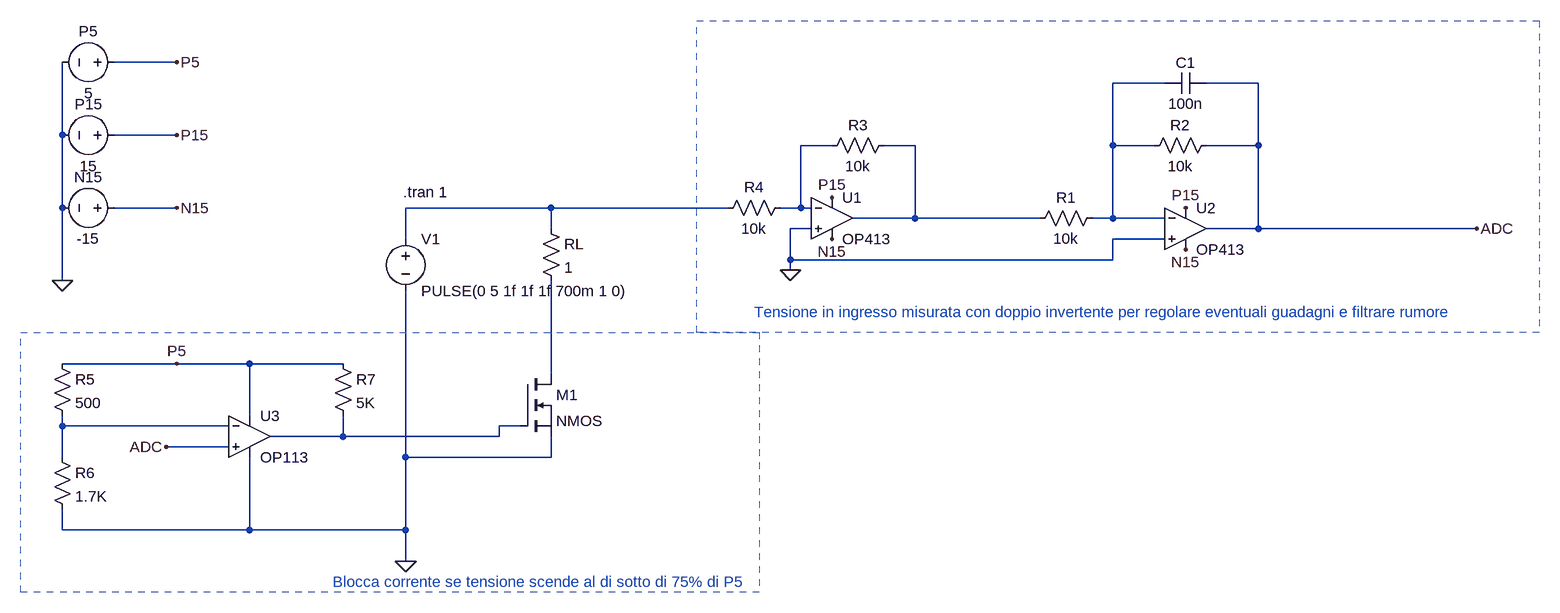
[diagram p0: schematic Circuito_Sorveglianza_Alimentazione.asc]
Circuito_Sorveglianza_Alimentazione.asc, the LTspice schematic file:
Version 4
SHEET 1 1748 680
WIRE -400 -288 -496 -288
WIRE 1120 -256 1040 -256
WIRE 1264 -256 1184 -256
WIRE -576 -176 -576 -288
WIRE -400 -176 -496 -176
WIRE 608 -160 560 -160
WIRE 736 -160 688 -160
WIRE 1040 -160 1040 -256
WIRE 1104 -160 1040 -160
WIRE 1264 -160 1264 -256
WIRE 1264 -160 1184 -160
WIRE -576 -64 -576 -176
WIRE -400 -64 -496 -64
WIRE 176 -64 -48 -64
WIRE 448 -64 176 -64
WIRE 560 -64 560 -160
WIRE 560 -64 528 -64
WIRE 576 -64 560 -64
WIRE 736 -48 736 -160
WIRE 736 -48 640 -48
WIRE 928 -48 736 -48
WIRE 1040 -48 1040 -160
WIRE 1040 -48 1008 -48
WIRE 1120 -48 1040 -48
WIRE 176 -32 176 -64
WIRE 576 -32 544 -32
WIRE 1264 -32 1264 -160
WIRE 1264 -32 1184 -32
WIRE 1600 -32 1264 -32
WIRE -48 -16 -48 -64
WIRE 1120 -16 1040 -16
WIRE 544 16 544 -32
WIRE 1040 16 1040 -16
WIRE 1040 16 544 16
WIRE 544 32 544 16
WIRE -576 48 -576 -64
WIRE -400 176 -576 176
WIRE -288 176 -400 176
WIRE -144 176 -288 176
WIRE 176 192 176 48
WIRE -288 256 -288 176
WIRE -576 272 -576 256
WIRE -320 272 -576 272
WIRE 128 272 96 272
WIRE -144 288 -144 256
WIRE -144 288 -256 288
WIRE 96 288 96 272
WIRE 96 288 -144 288
WIRE -320 304 -416 304
WIRE -576 320 -576 272
WIRE -48 320 -48 64
WIRE 176 320 176 288
WIRE 176 320 -48 320
WIRE -576 432 -576 400
WIRE -288 432 -288 320
WIRE -288 432 -576 432
WIRE -48 432 -48 320
WIRE -48 432 -288 432
WIRE -48 480 -48 432
FLAG 1600 -32 ADC
FLAG -576 48 0
FLAG -400 -64 N15
FLAG -400 -176 P15
FLAG 608 -80 P15
FLAG 608 -16 N15
FLAG 544 32 0
FLAG 1152 -64 P15
FLAG 1152 0 N15
FLAG -416 304 ADC
FLAG -400 176 P5
FLAG -400 -288 P5
FLAG -48 480 0
SYMBOL voltage -48 -32 R0
WINDOW 123 0 0 Left 0
WINDOW 39 0 0 Left 0
SYMATTR InstName V1
SYMATTR Value PULSE(0 5 1f 1f 1f 700m 1 0)
SYMBOL res 160 -48 R0
SYMATTR InstName RL
SYMATTR Value 1
SYMBOL nmos 128 192 R0
SYMATTR InstName M1
SYMBOL OpAmps\\OP413 608 -112 R0
SYMATTR InstName U1
SYMBOL voltage -480 -176 R90
WINDOW 0 -32 56 VBottom 2
WINDOW 3 32 56 VTop 2
SYMATTR InstName P15
SYMATTR Value 15
SYMBOL voltage -480 -64 R90
WINDOW 0 -32 56 VBottom 2
WINDOW 3 32 56 VTop 2
SYMATTR InstName N15
SYMATTR Value -15
SYMBOL res 1024 -64 R90
WINDOW 0 0 56 VBottom 2
WINDOW 3 32 56 VTop 2
SYMATTR InstName R1
SYMATTR Value 10k
SYMBOL res 1200 -176 R90
WINDOW 0 0 56 VBottom 2
WINDOW 3 32 56 VTop 2
SYMATTR InstName R2
SYMATTR Value 10k
SYMBOL OpAmps\\OP413 1152 -96 R0
SYMATTR InstName U2
SYMBOL res 704 -176 R90
WINDOW 0 0 56 VBottom 2
WINDOW 3 32 56 VTop 2
SYMATTR InstName R3
SYMATTR Value 10k
SYMBOL res 432 -48 R270
WINDOW 0 32 56 VTop 2
WINDOW 3 0 56 VBottom 2
SYMATTR InstName R4
SYMATTR Value 10k
SYMBOL OpAmps\\OP113 -288 224 R0
SYMATTR InstName U3
SYMBOL voltage -480 -288 R90
WINDOW 0 -32 56 VBottom 2
WINDOW 3 32 56 VTop 2
SYMATTR InstName P5
SYMATTR Value 5
SYMBOL res -592 160 R0
SYMATTR InstName R5
SYMATTR Value 500
SYMBOL res -592 304 R0
SYMATTR InstName R6
SYMATTR Value 1.7K
SYMBOL res -160 160 R0
SYMATTR InstName R7
SYMATTR Value 5K
SYMBOL cap 1184 -272 R90
WINDOW 0 0 32 VBottom 2
WINDOW 3 32 32 VTop 2
SYMATTR InstName C1
SYMATTR Value 100n
TEXT -52 -88 Left 2 !.tran 1
TEXT -160 512 Left 2 ;Blocca corrente se tensione scende al di sotto di 75% di P5
TEXT 488 96 Left 2 ;Tensione in ingresso misurata con doppio invertente per regolare eventuali guadagni e filtrare rumore
RECTANGLE Normal 496 528 -640 128 2
RECTANGLE Normal 1696 128 400 -352 2

The netlist it stands for:
* Circuito_Sorveglianza_Alimentazione.asc
V1 N004 0 PULSE(0 5 1f 1f 1f 700m 1 0)
RL N004 N005 1
M1 N005 N007 0 0 NMOS
XU1 0 N002 P15 N15 N003 OP413  ; pins In+ In- V+ V- OUT
V§P15 P15 0 15
V§N15 N15 0 -15
R1 N001 N003 10k
R2 ADC N001 10k
XU2 0 N001 P15 N15 ADC OP413  ; pins In+ In- V+ V- OUT
R3 N003 N002 10k
R4 N004 N002 10k
XU3 ADC N006 P5 0 N007 OP113  ; pins In+ In- V+ V- OUT
V§P5 P5 0 5
R5 P5 N006 500
R6 N006 0 1.7K
R7 P5 N007 5K
C1 ADC N001 100n
.model NMOS NMOS
.model PMOS PMOS
.lib standard.mos
.tran 1
* Blocca corrente se tensione scende al di sotto di 75% di P5
* Tensione in ingresso misurata con doppio invertente per regolare eventuali guadagni e filtrare rumore
.lib ADI.lib
.backanno
.end